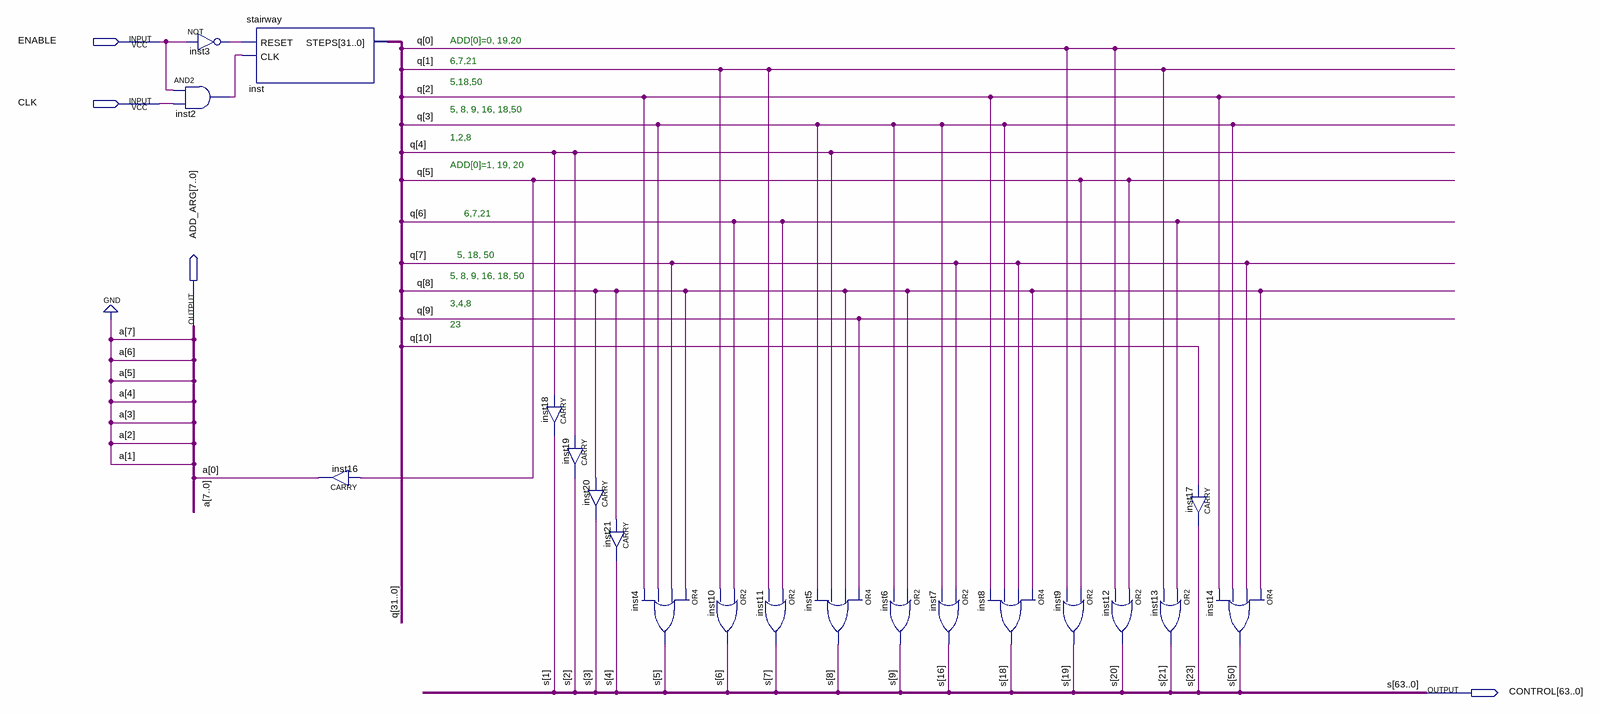
[diagram p0: schematic sheet]
// Quartus schematic macro_load_command.bdf as structural Verilog: 20 symbols, 4 pins
module macro_load_command (
  input  ENABLE,
  input  CLK,
  output [7:0] ADD_ARG,
  output [63:0] CONTROL
);

  wire inst2_out, inst3_out;
  wire [31:0] q;

  not inst3 (inst3_out, ENABLE);
  and inst2 (inst2_out, ENABLE, CLK);
  stairway inst (.RESET(inst3_out), .CLK(inst2_out), .STEPS(q));
  CARRY inst16 (.IN(q[5]), .OUT(ADD_ARG[0]));
  CARRY inst18 (.IN(q[4]), .OUT(CONTROL[1]));
  CARRY inst19 (.IN(q[4]), .OUT(CONTROL[2]));
  CARRY inst20 (.IN(q[8]), .OUT(CONTROL[3]));
  CARRY inst21 (.IN(q[8]), .OUT(CONTROL[4]));
  or inst4 (CONTROL[5], q[8], q[7], q[3], q[2]);
  or inst10 (CONTROL[6], q[6], q[1]);
  or inst11 (CONTROL[7], q[6], q[1]);
  or inst5 (CONTROL[8], q[9], q[8], q[4], q[3]);
  or inst6 (CONTROL[9], q[8], q[3]);
  or inst7 (CONTROL[16], q[7], q[3]);
  or inst8 (CONTROL[18], q[8], q[7], q[3], q[2]);
  or inst9 (CONTROL[19], q[5], q[0]);
  or inst12 (CONTROL[20], q[5], q[0]);
  CARRY inst17 (.IN(q[10]), .OUT(CONTROL[23]));
  or inst13 (CONTROL[21], q[6], q[1]);
  or inst14 (CONTROL[50], q[8], q[7], q[3], q[2]);

  assign ADD_ARG[7:1] = {7{1'b0}};

  // Other names for the same wires on the sheet: a[0] = ADD_ARG[0]; s[63:0] = CONTROL

  // Notes on the sheet:
  //   ADD[0]=0, 19,20
  //   6,7,21
  //   5,18,50
  //   5, 8, 9, 16, 18,50
  //   1,2,8
  //   ADD[0]=1, 19, 20
  //   6,7,21
  //   5, 18, 50
  //   5, 8, 9, 16, 18, 50
  //   3,4,8
  //   23
endmodule
